# Altium schematic sheet Power_Diagram.SchDoc
size A4; SheetNumber: 2; SheetTotal: 3
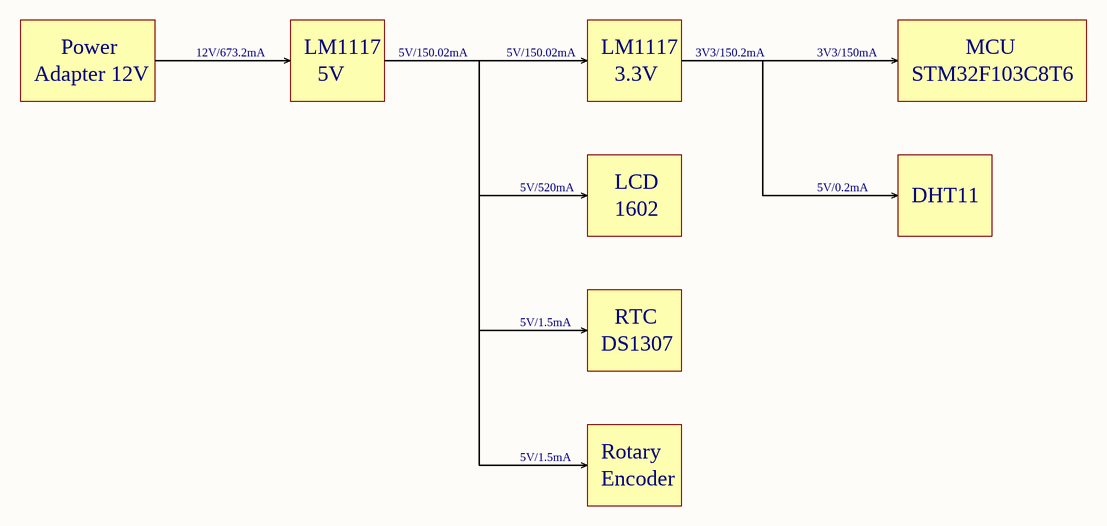
[diagram p0: Power_Diagram.SchDoc]

## Notes on the sheet
- Power
- 12V/673.2mA
- LM1117
- 5V/150.02mA
- 3V3/150.2mA
- 3V3/150mA
- MCU
- Adapter 12V
- 5V
- 3.3V
- STM32F103C8T6
- 5V/520mA
- LCD
- 5V/0.2mA
- 1602
- DHT11
- 5V/1.5mA
- RTC
- DS1307
- Rotary
- Encoder
- Title
- Size
- A4
- Number
- Revision
- Date:
- Drawn By: Quoc Thang
- Time:
- Checked By:
- File: D\Altium\Templates